# EAGLE schematic Hardware_Comp_V1 (EAGLE 9.5.2)
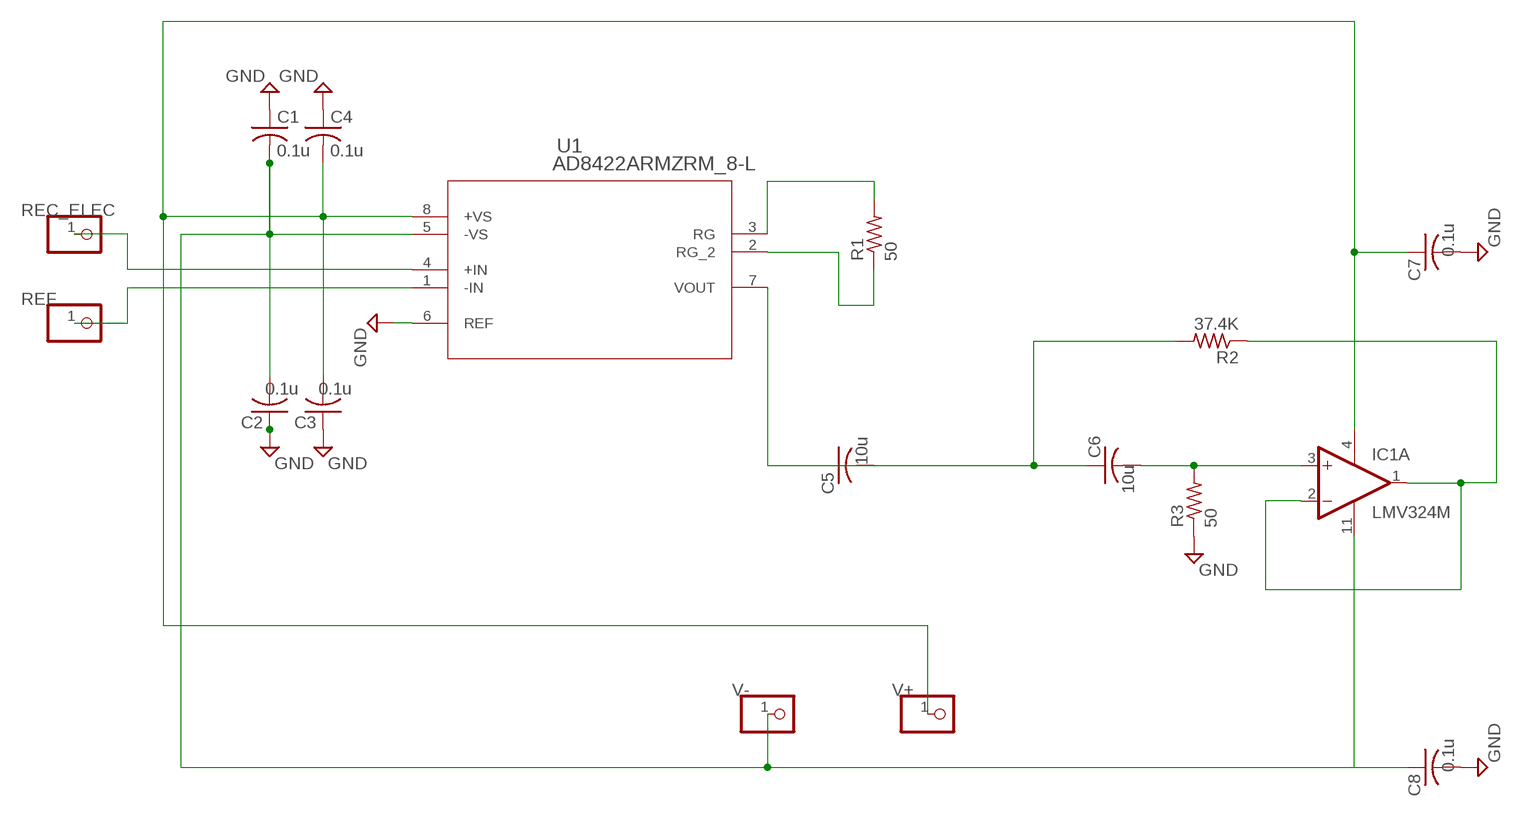
[diagram p0: schematic, sheet 1]

## Parts
9V-  PINHD-1X1  [1X01]
C1  0.1u  C-USC0603  [C0603]
C2  0.1u  C-USC0603  [C0603]
C3  0.1u  C-USC0603  [C0603]
C4  0.1u  C-USC0603  [C0603]
C5  10u  C-USC0603  [C0603]
C6  10u  C-USC0603  [C0603]
C7  0.1u  C-USC0603  [C0603]
C8  0.1u  C-USC0603  [C0603]
IC1  LMV324M  [SO14]
JP1  PINHD-1X1  [1X01]
JP2  PINHD-1X1  [1X01]
JP3  PINHD-1X1  [1X01]
R1  50  R-US_R0603  [R0603]
R2  37.4K  R-US_R0603  [R0603]
R3  50  R-US_R0603  [R0603]
U1  AD8422ARMZRM_8-L  [RM_8-L]

## Nets
GND: C1.1 C2.1 C3.1 C4.1 C7.2 C8.2 R3.1 U1.6(REF)
N$1: C5.2 U1.7(VOUT)
N$2: C5.1 C6.1 R2.2
N$3: C6.2 IC1.3(A:+IN) R3.2
N$4: IC1.1(A:OUT) IC1.2(A:-IN) R2.1
N$5: R1.2 U1.3(RG)
N$6: R1.1 U1.2(RG_2)
REC_ELEC: JP1.1 U1.4(+IN)
REF: JP2.1 U1.1(-IN)
V+: 9V-.1 C3.2 C4.2 C7.1 IC1.4(P:V+) U1.8(+VS)
V+1: C8.1
V-: C1.2 C2.2 IC1.11(P:V-) JP3.1 U1.5(-VS)
Unconnected: IC1.5(B:+IN) IC1.6(B:-IN) IC1.7(B:OUT) IC1.8(C:OUT) IC1.9(C:-IN) IC1.10(C:+IN) IC1.12(D:+IN) IC1.13(D:-IN) IC1.14(D:OUT)

## Library data of the parts
9V- JP1-JP3 = adafruit:PINHD-1X1: Pin header 1x1 for 0.1" spacing With round pins
C1-C8 = adafruit:C-US: CAPACITOR, American symbol
IC1 = linear:LMV324?*: Quad General Purpose, Low Voltage, Rail-to-Rail Output Operational Amplifiers Source: http://www.national.com/mpf/LM/LMV321.html http://www.national.com/dt/lmv_qual.pdf
R1-R3 = adafruit:R-US_: RESISTOR, American symbol
U1 = AD8422ARMZ:AD8422ARMZ; BUILT_BY: EMA_UL_Team; MANUFACTURER_PART_NUMBER: AD8422ARMZ; VENDOR: Analog Devices Inc